# EAGLE schematic screenShield (EAGLE 7.5.0)
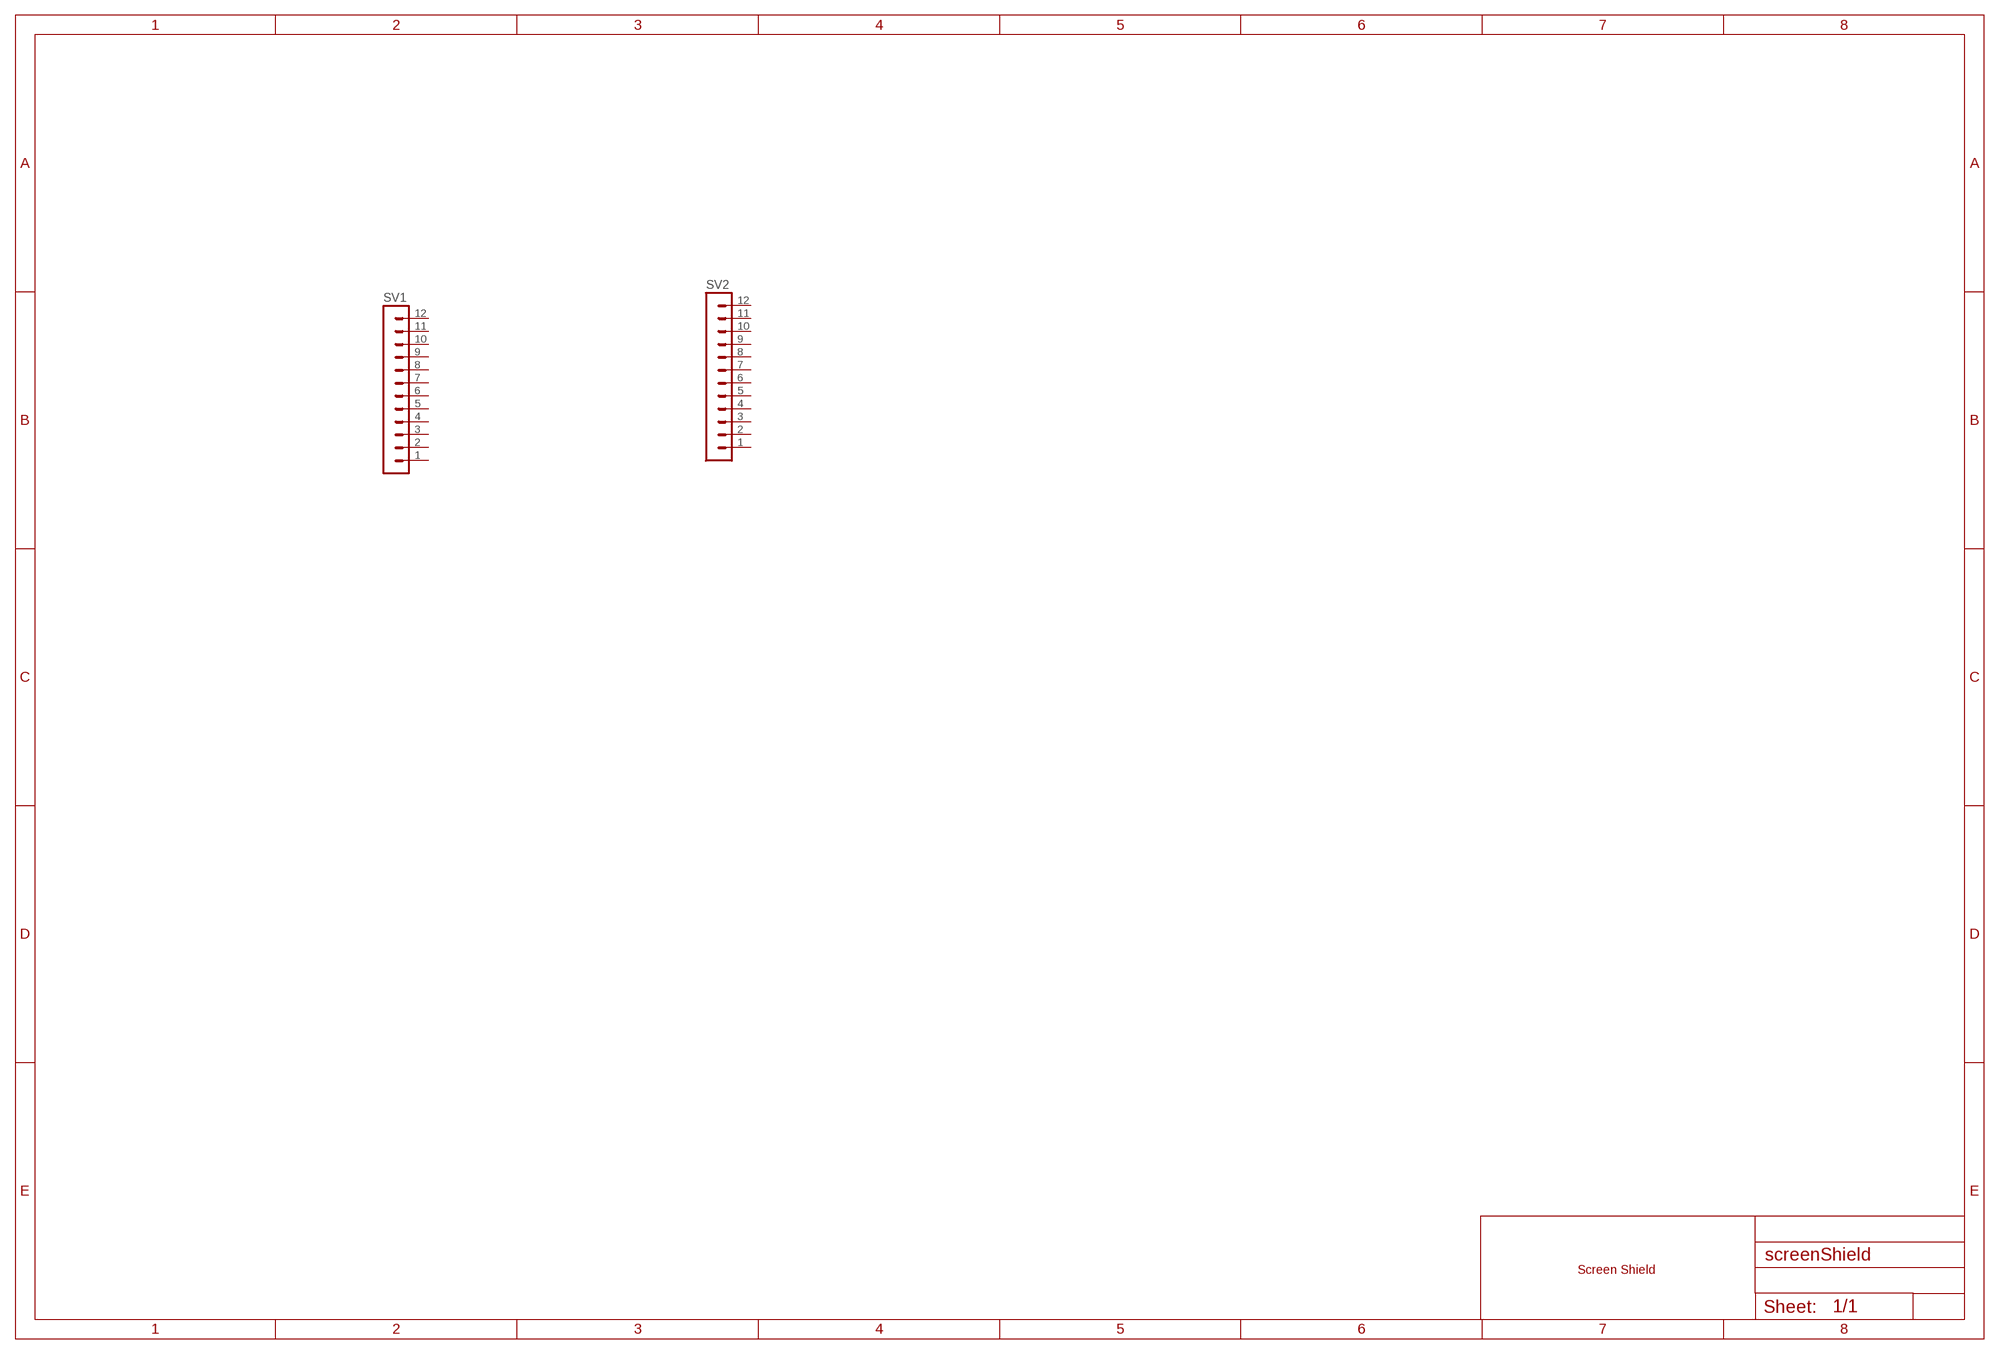
[diagram p0: schematic, sheet 1]

## Parts
SV1  MA12-1  [MA12-1]
SV2  MA12-1  [MA12-1]
Unconnected: SV1.1 SV1.2 SV1.3 SV1.4 SV1.5 SV1.6 SV1.7 SV1.8 SV1.9 SV1.10 SV1.11 SV1.12 SV2.1 SV2.2 SV2.3 SV2.4 SV2.5 SV2.6 SV2.7 SV2.8 SV2.9 SV2.10 SV2.11 SV2.12

## Notes on the sheet
- Screen Shield

## Library data of the parts
SV1 SV2 = con-lstb:MA12-1: PIN HEADER; OC_FARNELL: unknown; OC_NEWARK: unknown